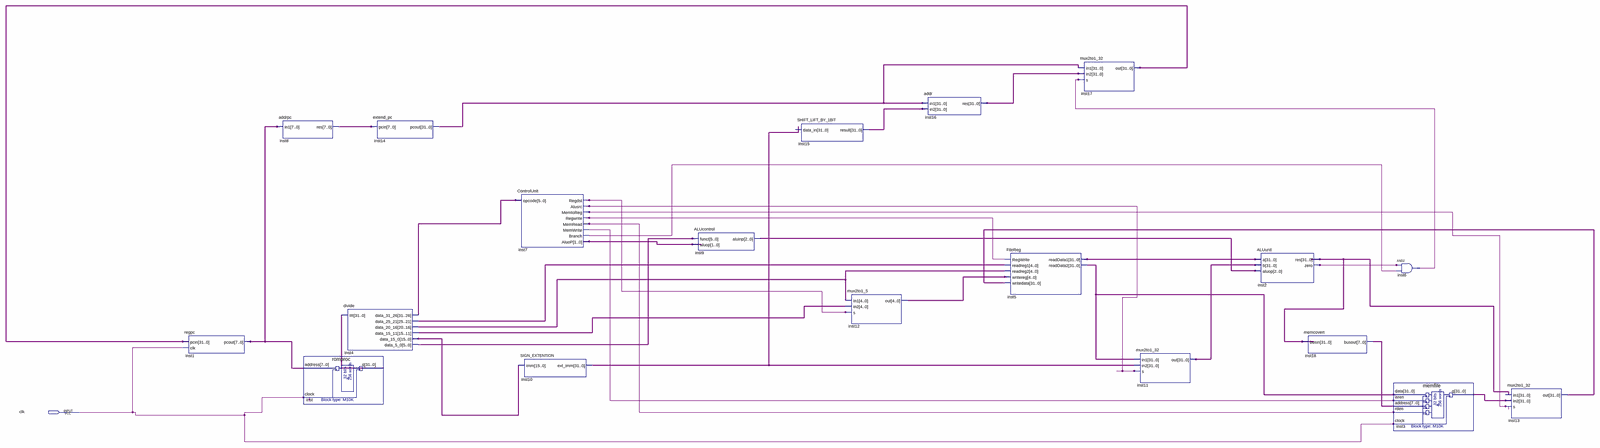
[diagram p0: schematic sheet, whole]
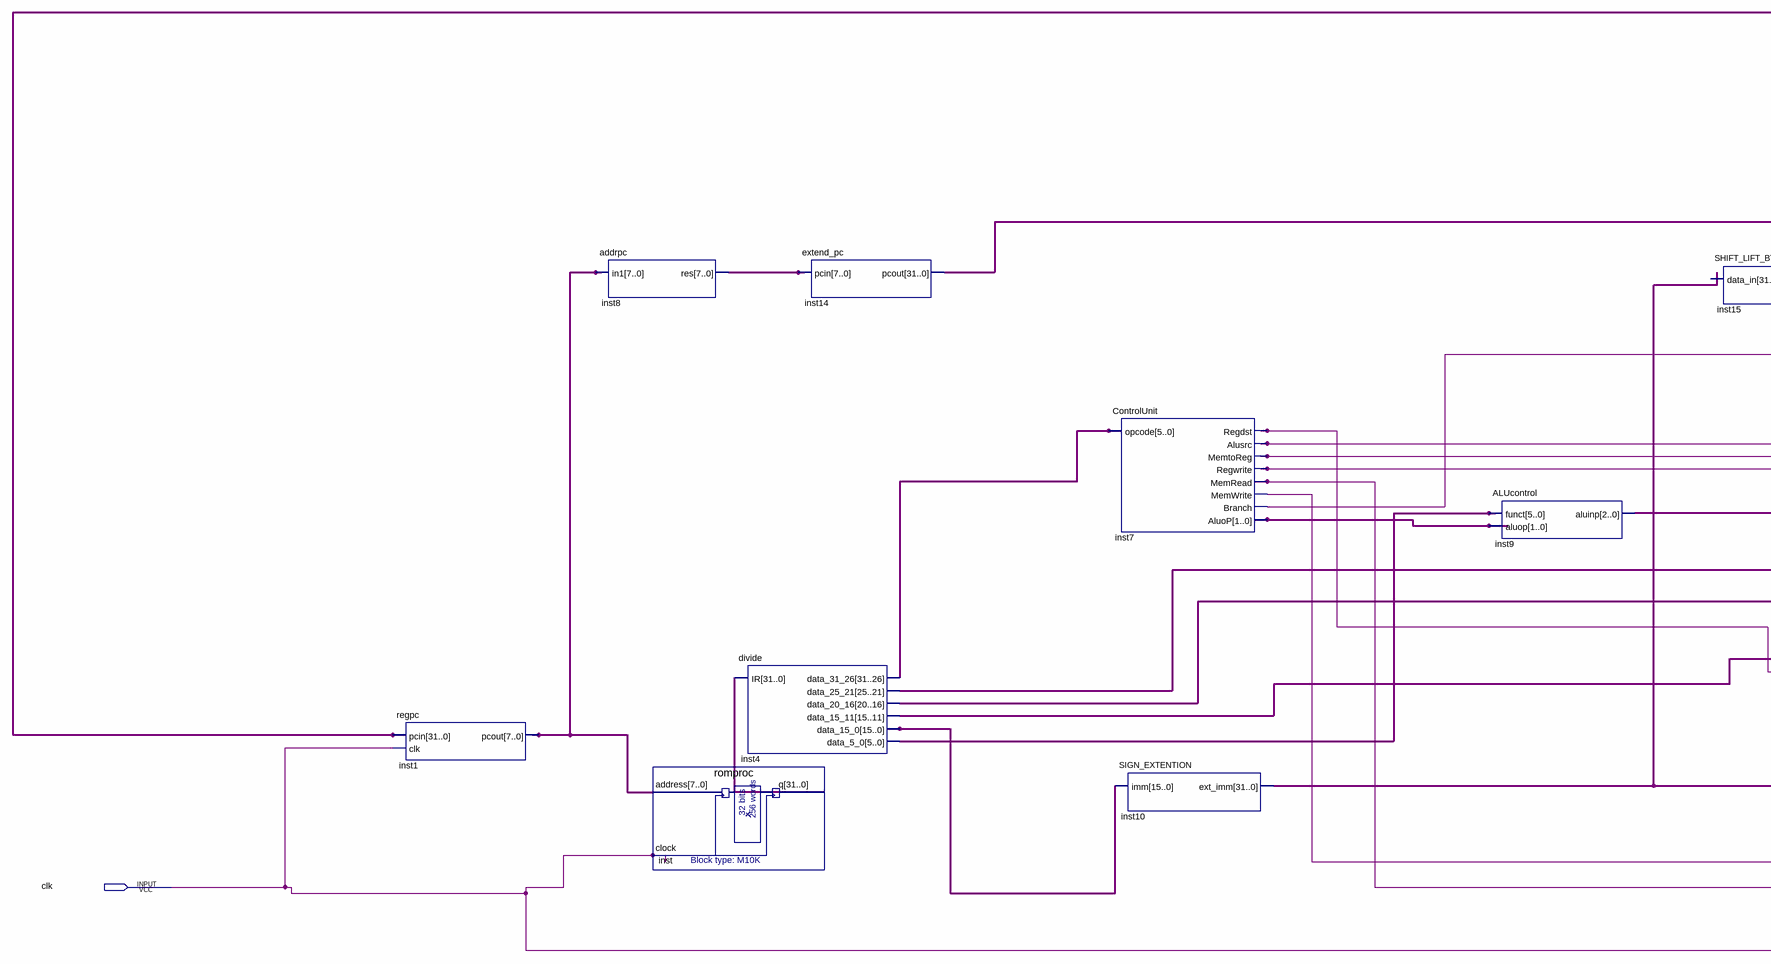
[diagram p1: schematic sheet, left part]
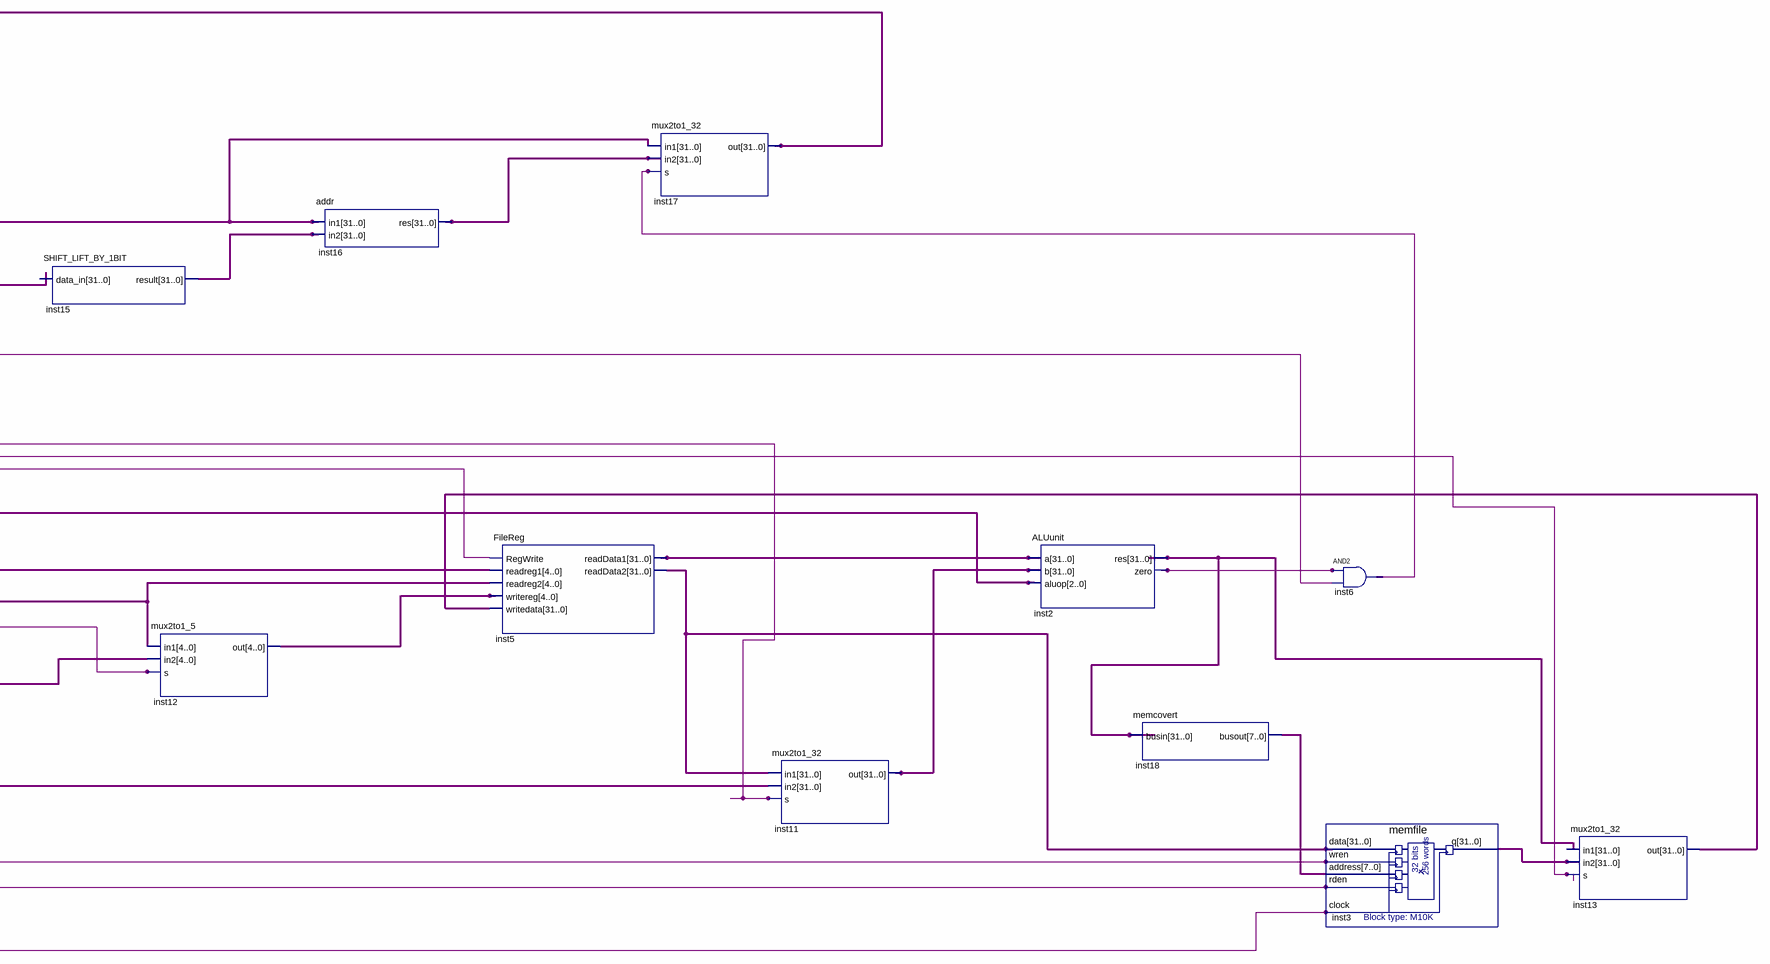
[diagram p2: schematic sheet, right part]
// Quartus schematic datapath.bdf as structural Verilog: 19 symbols, 1 pins
module datapath (
  input  clk
);

  wire inst2_zero, inst6_out, inst7_alusrc, inst7_branch, inst7_memread, inst7_memtoreg, inst7_memwrite,
       inst7_regdst, inst7_regwrite;
  wire [1:0] inst7_aluop;
  wire [2:0] inst9_aluinp;
  wire [4:0] inst4_data_15_11, inst4_data_20_16, inst4_data_25_21, inst12_out;
  wire [5:0] inst4_data_5_0, inst4_data_31_26;
  wire [7:0] inst1_pcout, inst8_res, inst18_busout;
  wire [15:0] inst4_data_15_0;
  wire [31:0] inst2_res, inst3_q, inst5_readdata1, inst5_readdata2, inst10_ext_imm, inst11_out, inst13_out,
       inst14_pcout, inst15_result, inst16_res, inst17_out, inst_q;

  regpc inst1 (.pcin(inst17_out), .clk(clk), .pcout(inst1_pcout));
  addrpc inst8 (.in1(inst1_pcout), .res(inst8_res));
  romproc inst (.address(inst1_pcout), .clock(clk), .q(inst_q));
  divide inst4 (
    .IR(inst_q), .data_31_26(inst4_data_31_26), .data_25_21(inst4_data_25_21), .data_20_16(inst4_data_20_16),
    .data_15_11(inst4_data_15_11), .data_15_0(inst4_data_15_0), .data_5_0(inst4_data_5_0));
  extend_pc inst14 (.pcin(inst8_res), .pcout(inst14_pcout));
  ControlUnit inst7 (
    .opcode(inst4_data_31_26), .Regdst(inst7_regdst), .Alusrc(inst7_alusrc), .MemtoReg(inst7_memtoreg),
    .Regwrite(inst7_regwrite), .MemRead(inst7_memread), .MemWrite(inst7_memwrite), .Branch(inst7_branch),
    .AluoP(inst7_aluop));
  SIGN_EXTENTION inst10 (.imm(inst4_data_15_0), .ext_imm(inst10_ext_imm));
  ALUcontrol inst9 (.funct(inst4_data_5_0), .aluop(inst7_aluop), .aluinp(inst9_aluinp));
  SHIFT_LIFT_BY_1BIT inst15 (.result(inst15_result));  // open: data_in
  mux2to1_5 inst12 (.in1(inst4_data_20_16), .in2(inst4_data_15_11), .s(inst7_regdst), .out(inst12_out));
  addr inst16 (.in1(inst14_pcout), .in2(inst15_result), .res(inst16_res));
  FileReg inst5 (
    .RegWrite(inst7_regwrite), .readreg1(inst4_data_25_21), .readreg2(inst4_data_20_16),
    .writereg(inst12_out), .writedata(inst13_out), .readData1(inst5_readdata1), .readData2(inst5_readdata2));
  mux2to1_32 inst17 (.in1(inst14_pcout), .in2(inst16_res), .s(inst6_out), .out(inst17_out));
  mux2to1_32 inst11 (.in1(inst5_readdata2), .in2(inst10_ext_imm), .s(inst7_alusrc), .out(inst11_out));
  ALUunit inst2 (.a(inst5_readdata1), .b(inst11_out), .aluop(inst9_aluinp), .res(inst2_res), .zero(inst2_zero));
  memcovert inst18 (.busin(inst2_res), .busout(inst18_busout));
  and inst6 (inst6_out, inst2_zero, inst7_branch);
  memfile inst3 (
    .data(inst5_readdata2), .wren(inst7_memwrite), .address(inst18_busout), .rden(inst7_memread),
    .clock(clk), .q(inst3_q));
  mux2to1_32 inst13 (.in2(inst3_q), .s(inst7_memtoreg), .out(inst13_out));  // open: in1
endmodule
